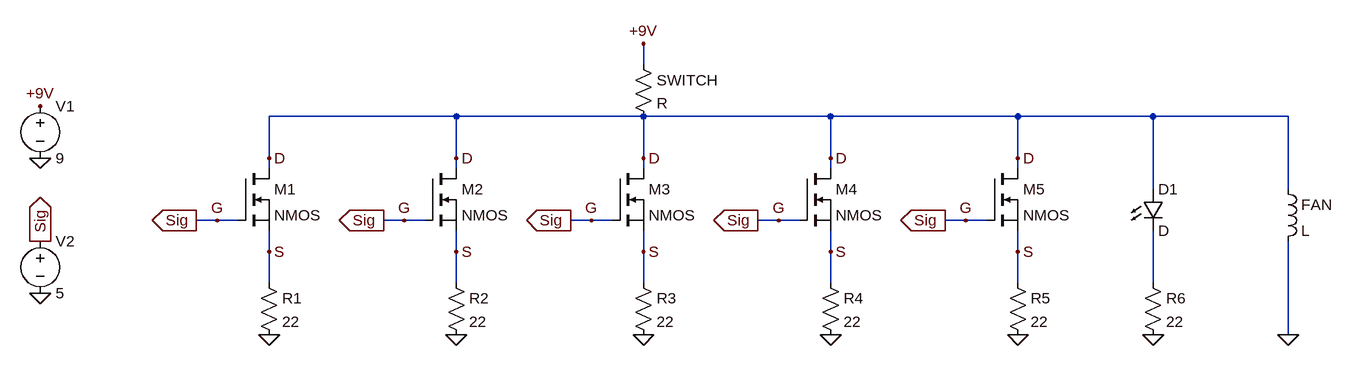
[diagram p0: schematic EE333ProjectHeatingElement.asc]
EE333ProjectHeatingElement.asc, the LTspice schematic file:
Version 4
SHEET 1 1928 680
WIRE 688 -64 688 -96
WIRE 400 16 112 16
WIRE 688 16 400 16
WIRE 976 16 688 16
WIRE 1264 16 976 16
WIRE 1472 16 1264 16
WIRE 1680 16 1472 16
WIRE 112 80 112 16
WIRE 400 80 400 16
WIRE 688 80 688 16
WIRE 976 80 976 16
WIRE 1264 80 1264 16
WIRE 112 96 112 80
WIRE 400 96 400 80
WIRE 688 96 688 80
WIRE 976 96 976 80
WIRE 1264 96 1264 80
WIRE 1472 128 1472 16
WIRE 1680 128 1680 16
WIRE 32 176 0 176
WIRE 64 176 32 176
WIRE 320 176 288 176
WIRE 352 176 320 176
WIRE 608 176 576 176
WIRE 640 176 608 176
WIRE 896 176 864 176
WIRE 928 176 896 176
WIRE 1184 176 1152 176
WIRE 1216 176 1184 176
WIRE 112 224 112 192
WIRE 400 224 400 192
WIRE 688 224 688 192
WIRE 976 224 976 192
WIRE 1264 224 1264 192
WIRE 112 272 112 224
WIRE 400 272 400 224
WIRE 688 272 688 224
WIRE 976 272 976 224
WIRE 1264 272 1264 224
WIRE 1472 272 1472 192
WIRE 1680 352 1680 208
FLAG 112 80 D
FLAG 112 224 S
FLAG 32 176 G
FLAG -240 80 0
FLAG -240 0 +9V
FLAG -240 288 0
FLAG -240 208 Sig
IOPIN -240 208 Out
FLAG 0 176 Sig
IOPIN 0 176 Out
FLAG 112 352 0
FLAG 400 80 D
FLAG 400 224 S
FLAG 320 176 G
FLAG 288 176 Sig
IOPIN 288 176 Out
FLAG 400 352 0
FLAG 688 80 D
FLAG 688 224 S
FLAG 608 176 G
FLAG 688 -96 +9V
FLAG 576 176 Sig
IOPIN 576 176 Out
FLAG 688 352 0
FLAG 976 80 D
FLAG 976 224 S
FLAG 896 176 G
FLAG 864 176 Sig
IOPIN 864 176 Out
FLAG 976 352 0
FLAG 1264 80 D
FLAG 1264 224 S
FLAG 1184 176 G
FLAG 1152 176 Sig
IOPIN 1152 176 Out
FLAG 1264 352 0
FLAG 1472 352 0
FLAG 1680 352 0
SYMBOL nmos 64 96 R0
SYMATTR InstName M1
SYMBOL voltage -240 -16 R0
WINDOW 123 0 0 Left 0
WINDOW 39 0 0 Left 0
SYMATTR InstName V1
SYMATTR Value 9
SYMBOL voltage -240 192 R0
WINDOW 123 0 0 Left 0
WINDOW 39 0 0 Left 0
SYMATTR InstName V2
SYMATTR Value 5
SYMBOL res 96 256 R0
SYMATTR InstName R1
SYMATTR Value 22
SYMBOL nmos 352 96 R0
SYMATTR InstName M2
SYMBOL res 384 256 R0
SYMATTR InstName R2
SYMATTR Value 22
SYMBOL nmos 640 96 R0
SYMATTR InstName M3
SYMBOL res 672 256 R0
SYMATTR InstName R3
SYMATTR Value 22
SYMBOL nmos 928 96 R0
SYMATTR InstName M4
SYMBOL res 960 256 R0
SYMATTR InstName R4
SYMATTR Value 22
SYMBOL nmos 1216 96 R0
SYMATTR InstName M5
SYMBOL res 1248 256 R0
SYMATTR InstName R5
SYMATTR Value 22
SYMBOL LED 1456 128 R0
SYMATTR InstName D1
SYMBOL res 1456 256 R0
SYMATTR InstName R6
SYMATTR Value 22
SYMBOL ind 1664 112 R0
SYMATTR InstName FAN
SYMBOL res 672 -80 R0
SYMATTR InstName SWITCH

The netlist it stands for:
* EE333ProjectHeatingElement.asc
M1 D Sig S S NMOS
V1 +9V 0 9
V2 Sig 0 5
R1 S 0 22
M2 D Sig S S NMOS
R2 S 0 22
M3 D Sig S S NMOS
R3 S 0 22
M4 D Sig S S NMOS
R4 S 0 22
M5 D Sig S S NMOS
R5 S 0 22
D1 D N001 D
R6 N001 0 22
L§FAN D 0 L
R§SWITCH +9V D R
.model D D
.lib standard.dio
.model NMOS NMOS
.model PMOS PMOS
.lib standard.mos
.backanno
.end